# EAGLE design row (EAGLE 6.1)
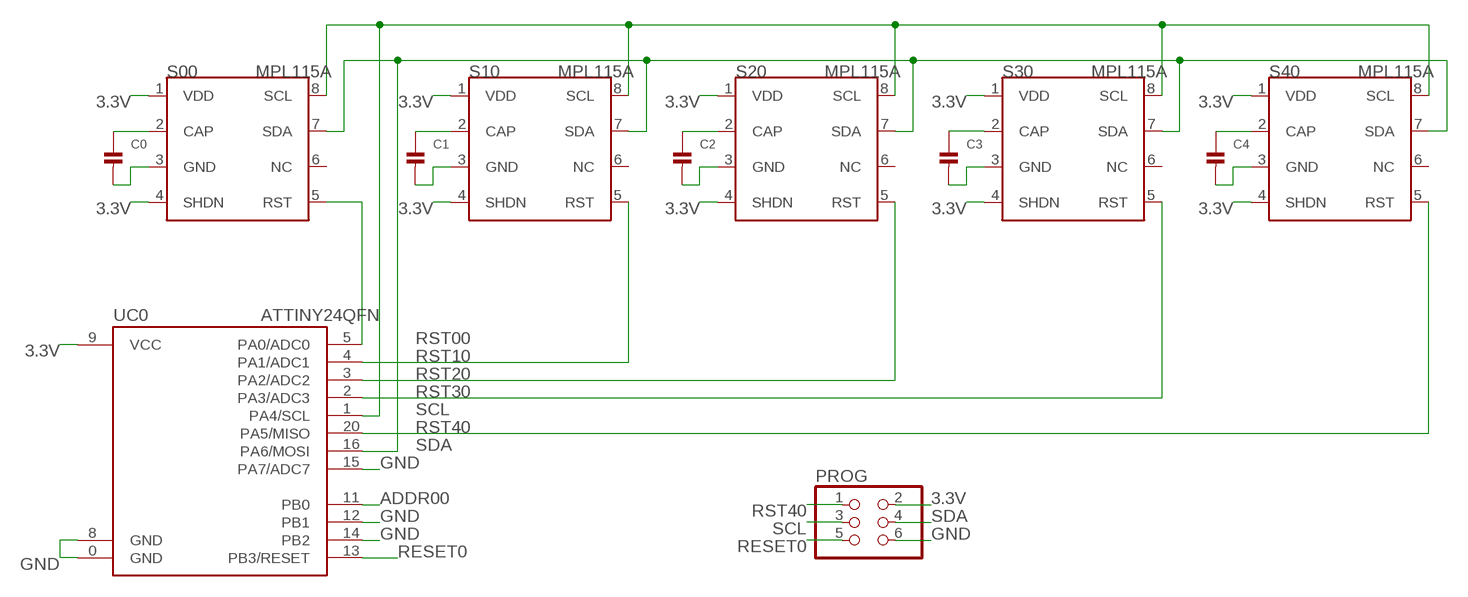
[diagram p0: schematic, sheet 1]

## Parts
C0  CAP_CERAMIC0603  [0603]
C1  CAP_CERAMIC0603  [0603]
C2  CAP_CERAMIC0603  [0603]
C3  CAP_CERAMIC0603  [0603]
C4  CAP_CERAMIC0603  [0603]
PROG  HEADER-2X3  [2X03]
S00  MPL115A  [LGA-8]
S10  MPL115A  [LGA-8]
S20  MPL115A  [LGA-8]
S30  MPL115A  [LGA-8]
S40  MPL115A  [LGA-8]
UC0  ATTINY24QFN  [QFN20]

## Nets
3.3V: PROG.2 S00.1(VDD) S00.4(SHDN) S10.1(VDD) S10.4(SHDN) S20.1(VDD) S20.4(SHDN) S30.1(VDD) S30.4(SHDN) S40.1(VDD) S40.4(SHDN) UC0.9(VCC)
ADDR00: UC0.11(PB0)
CAP00: C0.1 S00.2(CAP)
CAP10: C1.1 S10.2(CAP)
CAP20: C2.1 S20.2(CAP)
CAP30: C3.1 S30.2(CAP)
CAP40: C4.1 S40.2(CAP)
GND: C0.2 C1.2 C2.2 C3.2 C4.2 PROG.6 S00.3(GND) S10.3(GND) S20.3(GND) S30.3(GND) S40.3(GND) UC0.0(GND) UC0.8(GND) UC0.12(PB1) UC0.14(PB2) UC0.15(PA7/ADC7)
RESET0: PROG.5 UC0.13(PB3/RESET)
RST00: S00.5(RST) UC0.5(PA0/ADC0)
RST10: S10.5(RST) UC0.4(PA1/ADC1)
RST20: S20.5(RST) UC0.3(PA2/ADC2)
RST30: S30.5(RST) UC0.2(PA3/ADC3)
RST40: PROG.1 S40.5(RST) UC0.20(PA5/MISO)
SCL: PROG.3 S00.8(SCL) S10.8(SCL) S20.8(SCL) S30.8(SCL) S40.8(SCL) UC0.1(PA4/SCL)
SDA: PROG.4 S00.7(SDA) S10.7(SDA) S20.7(SDA) S30.7(SDA) S40.7(SDA) UC0.16(PA6/MOSI)
Unconnected: S00.6(NC) S10.6(NC) S20.6(NC) S30.6(NC) S40.6(NC)

## Library data of the parts
C0 C1-C4 = nonolith:CAP_CERAMIC: Ceramic Capacitors 0402 - 0402 Surface Mount Capacitors 0.1uF 10V 10% [Digikey: 490-1318-2-ND] 0603 - 0603 Surface Mount Capacitors 16 pF 50V 5% [Digikey: 445-5051-2-ND] 22 pF 50V [Digikey: PCC220ACVTR-ND] 33 pF 50V 5% [Digikey: 490-1415-1-ND] 56pF 50V 5% [Digikey: 490-1421-1-ND] 220pF 50V 5% [Digikey: 445-1285-1-ND] 680 pF 50V 2200 pF 50V 5% C0G [Digikey: 445-1297-1-ND] 5600 pF 100V 5% X7R [Digikey: 478-3711-1-ND] 0.1 µF 25V 10% [Digikey: PCC2277TR-ND] 0.22 µF 16V 10% X7R [Digikey: 445-1318-1-ND] 1.0 µF 25V 10% [Digikey: 445-5146-2-ND] 0603 - RF Specific 3pF 250V +/-0.1pF RF [Digikey: 712-1347-1-ND] 18 pF 250V 5% [Digikey: 478-3505-1-ND or 712-1322-1-ND] 56 pF 250V 5% C0G RF [Digikey: 490-4867-1-ND] 68 pF 250V RF [Digikey: 490-4868-1-ND] 0805 - 0805 Surface Mount Capacitors 220 pF 250V 2% RF Ceramic Capacitor [Digikey: 712-1398-1-ND] 1000 pF 50V 2% NP0 Ceramic Capacitor [Digikey: 478-3760-1-ND] 0.1 µF 25V 10% Ceramic Capacitor [Digikey: PCC1828TR-ND] 1.0 µF 16V 10% Ceramic Capacitor[Digikey: 490-1691-2-ND] 10.0 µF 10V 10% Ceramic Capacitor[Digikey: 709-1228-1-ND] 1206 - 1206 Surface Mount Capacitors
PROG = nonolith:HEADER-2X3: PIN HEADER
S00 S10 S20 S30 S40 = nonolith:MPL115A: MPL115A1 (SPI) and MPL115A2 (I2C) Miniature Digital Barometer 5.0x3.0x1.2mm LGA Package
UC0 = nonolith:ATTINY24

## Board
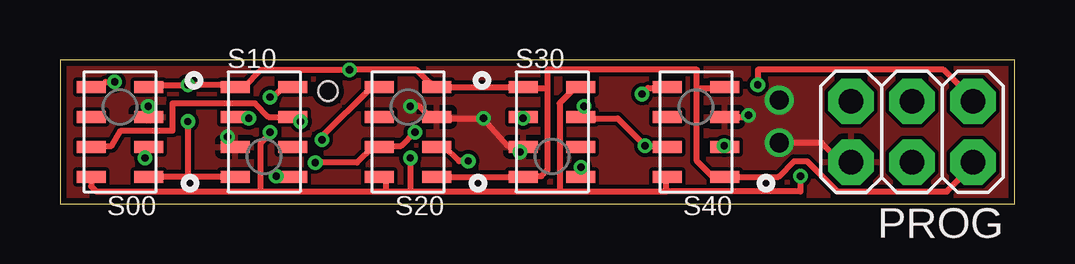
[diagram p1: board, top side]
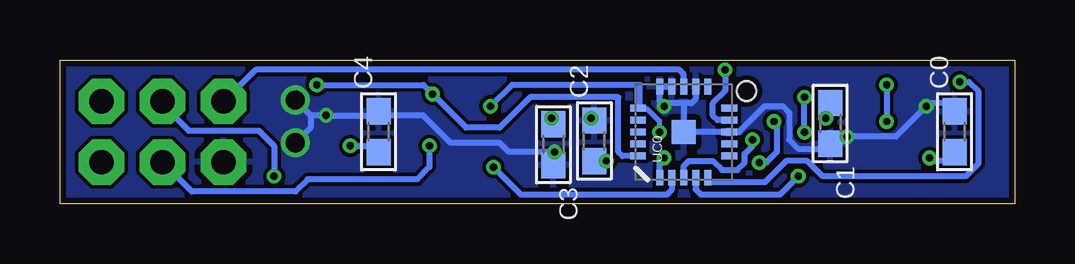
[diagram p2: board, bottom side, seen from below]

Size 39.77 x 6 mm. Coordinates in mm from the lower left corner, seen from the top.
Outline: 0,0 39.77,0 39.77,6 0,6 0,0
Copper layers (1*16): Top 0.035mm / dielectric 1.5mm / Bottom 0.035mm
Design rules: minimum track width 6mil, minimum drill 12mil, track to track 6mil, track to pad 6mil, pad to pad 6mil, via to via 6mil, smd to smd 0mil, copper to edge 10mil, drill to drill 10mil, minimum pad ring 10mil, minimum via ring 6mil, stop-mask expansion 2mil, vias tented up to drill 100mil, thermal gap 10mil
Holes 0.8 mm at 11.17,4.7

### Footprints (pad centres in the part's own frame; a part is rotated, then mirrored left to right if it is on the bottom)
0603 = smd 1.1 x 1: 1 -0.85,0; 2 0.85,0
2X03 = drill 1.016 pad 1.88 octagon: 1 -2.54,-1.27; 2 -2.54,1.27; 3 0,-1.27; 4 0,1.27; 5 2.54,-1.27; 6 2.54,1.27
LGA-8 = smd 1.2 x 0.5: 1 -1.2,1.875; 2 -1.2,0.625; 3 -1.2,-0.625; 4 -1.2,-1.875; 5 1.2,-1.875; 6 1.2,-0.625; 7 1.2,0.625; 8 1.2,1.875
QFN20 = smd 1 x 1: 0 0,0 | smd 0.65 x 0.3: 1 -1.9,1; 2 -1.9,0.5; 3 -1.9,0; 4 -1.9,-0.5; 5 -1.9,-1; 11 1.9,-1; 12 1.9,-0.5; 13 1.9,0; 14 1.9,0.5; 15 1.9,1 | smd 0.3 x 0.65: 6 -1,-1.9; 7 -0.5,-1.9; 8 0,-1.9; 9 0.5,-1.9; 10 1,-1.9; 16 1,1.9; 17 0.5,1.9; 18 0,1.9; 19 -0.5,1.9; 20 -1,1.9

### Placement (x,y rotation side)
C0  2.5,3 90 bottom
C1  7.68,3.35 270 bottom
C2  17.51,2.62 90 bottom
C3  19.22,2.46 270 bottom
C4  26.5,3 90 bottom
PROG  35.5,3 180 top
S00  2.5,3 180 top
S10  8.5,3 0 top
S20  14.5,3 180 top
S30  20.5,3 0 top
S40  26.5,3 180 top
UC0  13.79,2.99 90 bottom

### Tracks (layer width: path | path; a pad name or v marks a point on that pad's centre or on a via)
3.3V  (via drill 0.3)
  Top 0.254: S30.1 S20.4 15.32,5.12 14.85,5.59 v12.06,5.59 8.37,5.59 7.66,4.88 S10.1 | S20.1 S30.4 19.19,1.12 19.17,1.14 20.06,1.14 20.31,1.4 20.31,4.83 | S10.1 7.25,4.83 | 26.54,4.83 27.68,4.83 27.7,4.85 S40.4 | S30.1 19.3,4.95 19.68,4.95 19.8,4.83 | 19.8,4.83 20.31,4.83 | 6.85,4.95 7.1,4.95 S10.1 | 7.36,4.83 7.35,4.83 | 7.35,4.83 S10.1 | S00.4 3.98,4.88 4.18,4.95 v5.33,4.95 6.85,4.95 | S00.1 3.72,1.14 5.33,1.14 | 5.33,1.14 6.72,1.14 | 6.72,1.14 6.74,1.12 S10.4 7.34,1.12 7.36,1.14 | 7.35,4.83 6.98,4.83 6.85,4.95 | v5.33,3.43 5.33,1.14 | 6.72,1.14 7.36,1.14 | 7.49,1.14 7.36,1.14 | 26.54,4.83 26.54,1.78 27.17,1.14 27.68,1.14 S40.1 29.95,1.12 30.6,1.78 31.11,1.78 32.38,0.51 36.95,0.51 37.97,1.52 PROG.2 | 26.54,4.83 26.54,5.59 20.31,5.59 20.31,4.83 | 19.8,4.83 19.35,4.83 S30.1
  Bottom 0.254: v5.33,4.95 v5.33,3.43 | UC0.9 12.37,3.49 12.56,3.68 12.56,4.19 12.06,4.7 v12.06,5.59
CAP00  (via drill 0.3)
  Top 0.254: v3.55,1.91 3.55,2.29 3.67,2.41 | 3.67,2.29 3.67,2.41 | 3.67,2.41 S00.2
  Bottom 0.254: C0.1 2.53,2.12 2.53,1.91 2.66,1.78 3.29,1.78 3.42,1.78 v3.55,1.91
CAP10  (via drill 0.3)
  Top 0.254: 7.23,3.56 S10.2 7.8,3.62 v7.87,3.56
  Bottom 0.254: v7.87,3.56 7.87,3.94 7.94,3.94 C1.1
CAP20  (via drill 0.3)
  Top 0.254: v17.01,1.78 16.63,1.78 15.99,2.41 15.96,2.38 S20.2
  Bottom 0.254: v17.01,1.78 17.25,2.02 17.4,1.9 | 17.4,1.9 17.39,2.03 17.39,1.91 17.4,1.9 | 17.4,1.9 C2.1
CAP30  (via drill 0.3)
  Top 0.254: v19.3,3.56 19.68,3.56 S30.2
  Bottom 0.254: C3.1 v19.3,3.56 19.3,3.17
CAP40  (via drill 0.3)
  Top 0.254: S40.2 27.23,2.41 27.36,2.48 27.68,2.29 v27.68,2.41
  Bottom 0.254: v27.68,2.41 26.54,2.41 C4.1
GND  (via drill 0.3, 0.8)
  Top 0.254: 15.8,3.62 15.87,3.56 v17.64,3.56 18.66,2.41 | 15.8,3.62 S20.3 15.76,3.68 15.74,3.68 | 15.8,3.62 15.74,3.68 | S30.3 19.33,2.38 19.04,2.41 | 15.74,3.68 15.36,3.68 14.98,4.06 v14.6,4.06 | S00.3 3.67,3.65 v3.67,4.06 | 18.66,2.41 19.04,2.41 | 19.04,2.41 S30.3 | S10.3 6.98,2.44 v6.98,2.79 | 33,1.75 32.98,1.73 PROG.6 32.55,1.73 31.74,2.54 v29.96,2.54 | S30.3 19.42,2.38 | 19.42,2.38 18.66,2.41 | 19.42,2.38 v19.17,2.16 | S40.3 28.65,3.62 v28.69,3.68 28.69,3.62 S40.3
  Bottom 0.254: UC0.14 UC0.15 14.79,4.25 v14.6,4.06 14.72,4.19 13.78,4.19 | 13.78,4.19 13.78,3.23 UC0.0 13.84,3.06 | UC0.12 13.29,4.36 13.45,4.19 13.78,4.19 | C0.2 2.66,4.01 2.66,4.06 2.79,4.06 2.91,4.19 3.55,4.19 v3.67,4.06 4.95,2.79 v6.98,2.79 7.36,2.41 7.87,2.41 7.93,2.35 | 13.84,3.06 13.84,3.17 13.71,3.05 13.64,2.99 UC0.8 11.48,2.99 10.41,4.06 9.64,4.06 9.39,3.81 9.39,2.67 9.01,2.29 7.99,2.29 7.93,2.35 | 13.84,3.05 13.84,3.06 | C3.2 19.21,1.61 v19.17,2.16 21.07,2.16 21.45,2.54 23.49,2.54 24.63,3.68 26.33,3.68 C4.2 26.54,3.81 26.66,3.68 v28.69,3.68 29.33,3.68 | C2.2 17.64,3.61 17.64,3.81 17.26,3.81 17.64,3.3 v17.64,3.56 | C1.2 8.06,2.38 7.93,2.35 | 29.33,3.68 v29.96,4.32 | 29.33,3.68 29.33,3.17 v29.96,2.54
  pour Bottom: 40,0 40,6 0,6 0,0
  pour Top: 0,6 0,0 40,0 40,6
RESET0
  Bottom 0.254: UC0.13 13.79,5.39 13.79,5.41 13.96,5.59 31.61,5.59 32.93,4.27 PROG.5
RST00  (via drill 0.3)
  Top 0.254: S00.5 1.59,4.88 1.64,4.83 1.9,5.08 v2.28,5.08
  Bottom 0.254: v2.28,5.08 1.9,5.08 1.52,4.7 1.52,1.65 2.02,1.14 7.99,1.14 8.63,1.78 9.52,1.78 10.41,0.89 12.82,0.89 12.79,0.92 UC0.5
RST10  (via drill 0.3)
  Top 0.254: v9.01,1.14 9.72,1.14 S10.5
  Bottom 0.254: UC0.4 13.29,0.59 13.07,0.38 9.77,0.38 v9.01,1.14
RST20  (via drill 0.3)
  Top 0.254: S20.5 13.45,4.85 13.45,4.83 12.95,4.83 10.91,2.79 v10.91,2.67
  Bottom 0.254: UC0.3 13.79,1.57 13.58,1.78 12.56,1.78 12.18,1.4 11.55,1.4 11.24,1.7 11.24,2.08 10.91,2.41 v10.91,2.67
RST30  (via drill 0.3)
  Top 0.254: S30.5 21.72,1.14 v21.71,1.52
  Bottom 0.254: v21.71,1.52 20.57,0.38 14.47,0.38 14.29,0.56 UC0.2
RST40  (via drill 0.3)
  Top 0.254: v24.25,4.57 24.5,4.83 25.25,4.83 S40.5 | PROG.1 38.01,4.27 37.97,4.32 37.97,4.45 36.82,5.59 29.07,5.59 v29.07,4.95
  Bottom 0.254: UC0.20 16.33,1.99 16.5,2.16 16.5,4.45 20.18,4.45 21.45,3.17 22.85,3.17 v24.25,4.57 24.63,4.95 v29.07,4.95
SCL  (via drill 0.3)
  Top 0.254: S00.8 1.3,0.72 1.52,0.51 8.37,0.51 | 8.37,0.51 13.58,0.51 | 20.82,0.51 25.27,0.51 | 25.27,1.02 25.27,1.14 25.28,1.12 S40.8 25.3,1.05 25.27,1.02 | S30.8 21.75,4.83 21.45,4.83 20.82,4.19 20.82,0.51 | 9.52,4.83 9.75,4.83 | 9.77,4.83 9.75,4.83 | 9.75,4.83 S10.8 9.65,4.83 9.26,4.83 8.76,4.32 v8.76,4.45 | v30.85,1.14 30.85,0.51 25.27,0.51 | 25.3,0.54 25.27,0.51 | 25.27,0.51 25.27,1.02 | S20.8 13.57,1.14 | 13.58,1.13 13.58,1.14 13.57,1.14 | 8.37,0.51 8.37,2.54 8.76,2.92 v8.76,2.98 8.76,3.05 | 13.57,1.14 13.58,1.13 | 13.58,1.13 13.58,0.51 | 13.58,0.51 14.6,0.51 | 14.6,0.51 20.82,0.51 | v14.6,1.91 14.6,0.51
  Bottom 0.254: v8.76,2.98 v8.76,4.45 | PROG.3 35.48,4.27 35.42,4.32 35.42,4.06 34.41,3.05 31.49,3.05 30.85,2.41 v30.85,1.14 | UC0.1 14.79,1.72 v14.6,1.91
SDA  (via drill 0.3)
  Top 0.203: S20.7 13.42,2.38 13.45,2.41
  Top 0.254: S00.7 1.64,2.41 2.15,2.41 2.53,3.05 4.69,3.05 4.69,4.19 8.12,4.19 8.69,3.62 S10.7 | 9.46,3.62 S10.7 | 21.84,3.56 21.77,3.56 S30.7 22.02,3.62 | 22.02,3.62 21.84,3.56 | v21.84,4.06 21.84,3.56 | 13.45,2.41 14.22,2.41 v14.79,2.98 | 22.02,3.62 22.09,3.56 23.23,3.56 v24.38,2.41 25.26,2.41 S40.7 | 13.07,2.41 13.11,2.38 S20.7 13.07,2.38 13.07,2.41 | S10.7 v10.03,3.43 | 13.07,2.41 12.37,1.71 v10.63,1.71
  Bottom 0.203: UC0.16 15.35,3.99 14.79,3.43 v14.79,2.98
  Bottom 0.254: 15.79,3.99 UC0.16 15.51,3.99 15.51,4 15.55,4 15.61,4.06 15.61,4.95 20.95,4.95 v21.84,4.06 | v24.38,2.41 24.38,1.52 24.88,1.02 29.46,1.02 29.96,0.51 34.28,0.51 PROG.4 | v10.03,3.43 9.9,3.43 9.9,2.16 10.34,1.71 v10.63,1.71